# EAGLE design Millable_AS726x_Breakout (EAGLE 7.7.0)
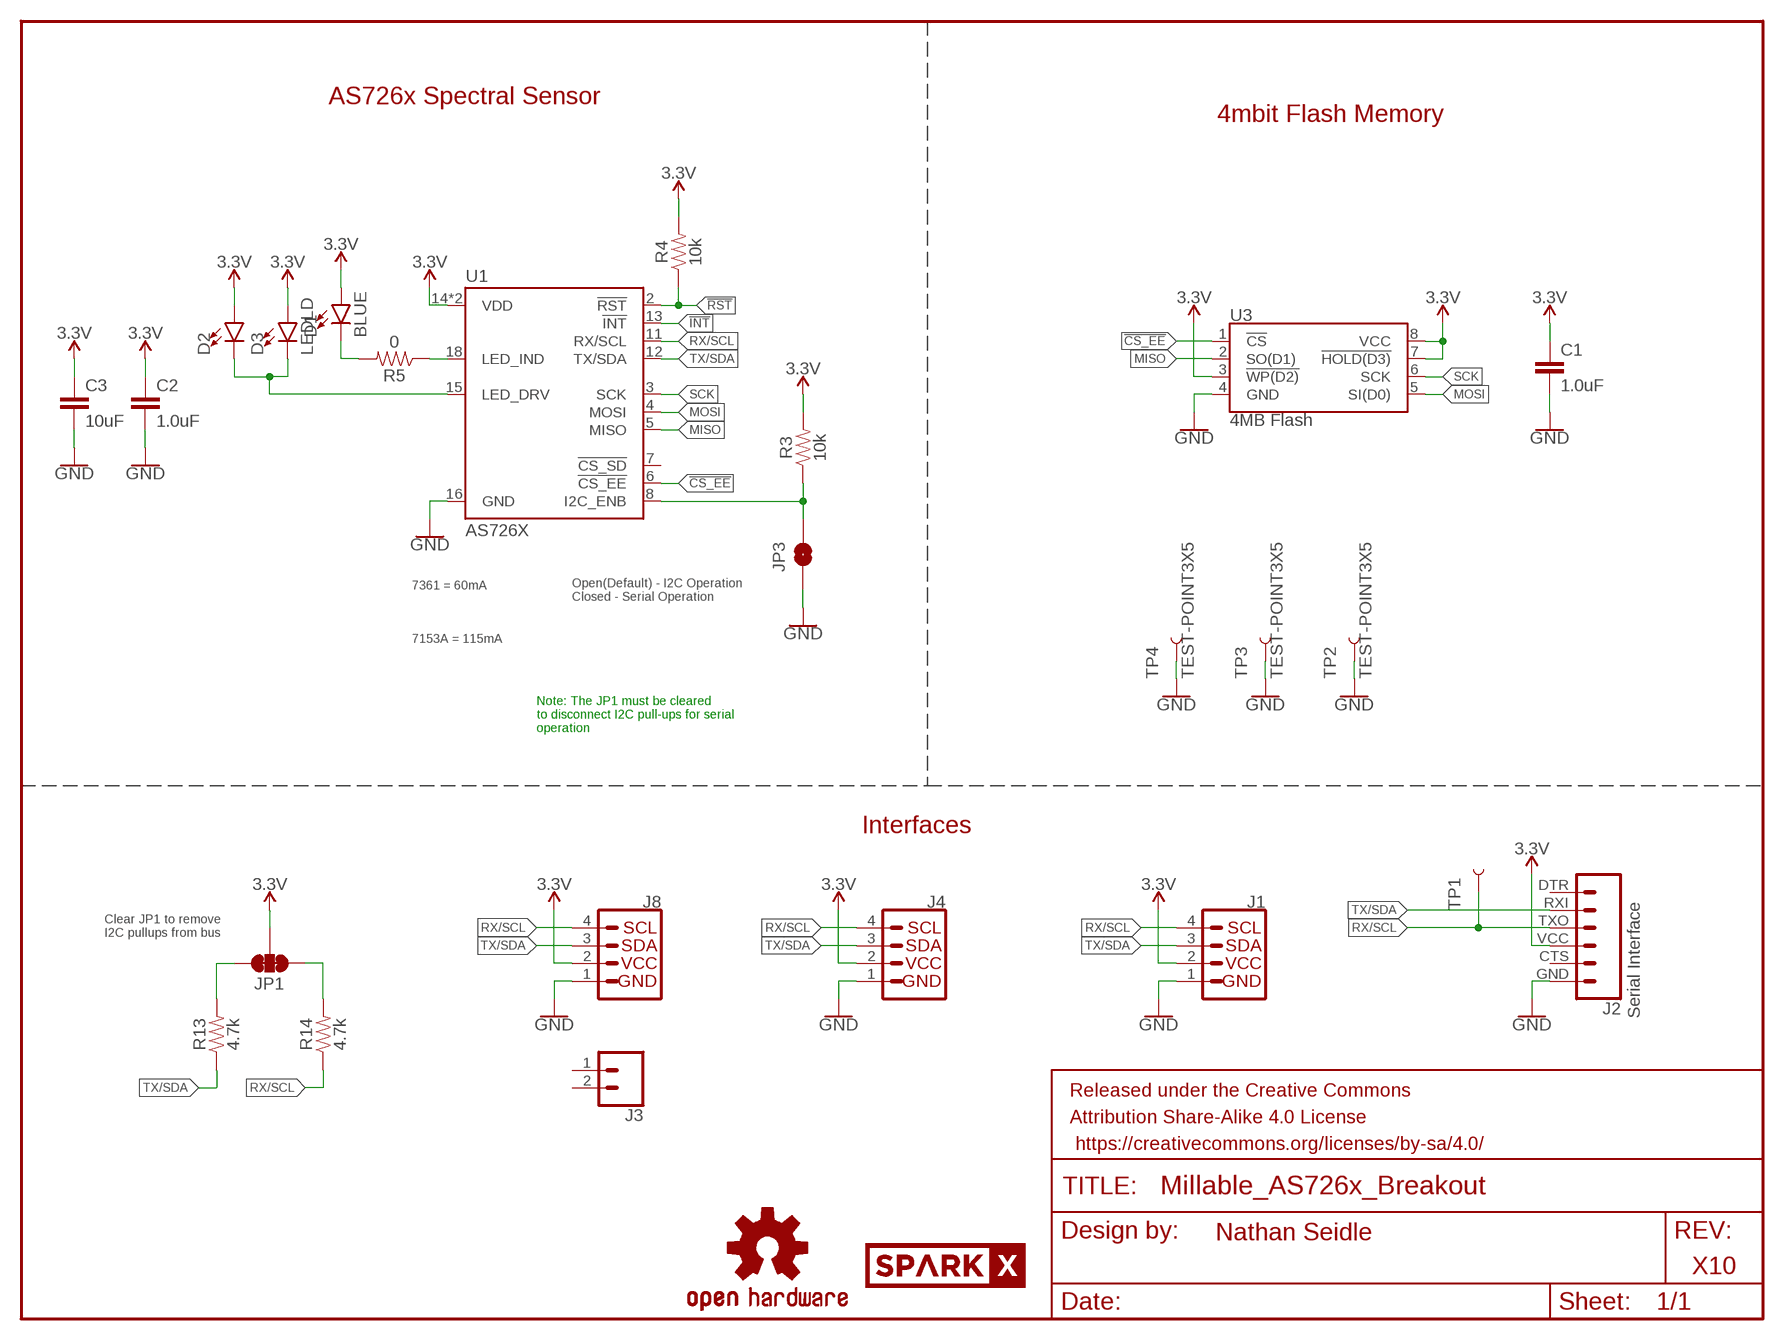
[diagram p0: schematic, sheet 1]

## Parts
C1  1.0uF  1.0UF-0603-16V-10%  [0603]
C2  1.0uF  1.0UF-0603-16V-10%  [0603]
C3  10uF  10UF-0603-6.3V-20%  [0603]
D1  BLUE  LED-BLUE0603  [LED-0603]
D2  LED5MM  [LED_5MM]
D3  LEDLD  [SUPER_BRIGHT_SMD_LED_1206]
FRAME1  FRAME-LETTER  [CREATIVE_COMMONS]
J1  I2C_STANDARDJS-1MM  [1X04_1MM_RA]
J2  Serial Interface  6_PIN_SERIAL_CABLEPTH  [FTDI_BASIC]
J3  CONN_021X02_NO_SILK  [1X02_NO_SILK]
J4  I2C_STANDARDJS-1MM  [1X04_1MM_RA]
J8  I2C_STANDARD_NO_SILK  [1X04_NO_SILK]
JP1  JUMPER-SMT_3_2-NC_TRACE_SILK  [SMT-JUMPER_3_2-NC_TRACE_SILK]
JP3  JUMPER-SMT_2_NO-MILLABLE_NO-SILK  [SMT-JUMPER_2_NO_NO-SILK]
LOGO4  OSHW-LOGOS  [OSHW-LOGO-S]
R3  10k  10KOHM-0603-1/10W-1%  [0603]
R4  10k  10KOHM-0603-1/10W-1%  [0603]
R5  0  0OHM-0603-1/10W-5%  [0603]
R13  4.7k  4.7KOHM-0603-1/10W-1%  [0603]
R14  4.7k  4.7KOHM-0603-1/10W-1%  [0603]
TP1  TEST-POINT3X5  [PAD.03X.05]
TP2  TEST-POINT3X5  [PAD.03X.05]
TP3  TEST-POINT3X5  [PAD.03X.05]
TP4  TEST-POINT3X5  [PAD.03X.05]
U1  AS726X  [LGA20]
U3  4MB Flash  AT25SF041  [SO08]
U$1  SPARKX-LOGO3  [SPARKX-SMALL]

## Nets
3.3V: C1.1 C2.1 C3.1 D1.A D2.A D3.A J1.2(VCC) J2.VCC J4.2(VCC) J8.2 JP1.2 R3.2 R4.2 U1.14(VDD) U1.17(VDD) U3.3(!WP(D2)) U3.7(!HOLD(D3)) U3.8(VCC)
!CS_EE: U1.6(!CS_EE) U3.1(!CS)
!INT: U1.13(!INT)
!RST: R4.1 U1.2(!RST)
GND: C1.2 C2.2 C3.2 J1.1(GND) J2.GND J4.1(GND) J8.1 JP3.1 TP2.P$1 TP3.P$1 TP4.P$1 U1.16(GND) U3.4(GND)
I2C_ENB: JP3.2 R3.1 U1.8(I2C_ENB)
MISO: U1.5(MISO) U3.2(SO(D1))
MOSI: U1.4(MOSI) U3.5(SI(D0))
N$2: R5.1 U1.18(LED_IND)
N$3: D1.C R5.2
N$4: JP1.3 R13.2
N$5: JP1.1 R14.2
N$6: D2.K(C) D3.C U1.15(LED_DRV)
RX/SCL: J1.4(SCL) J2.TXO J4.4(SCL) J8.4 R14.1 TP1.P$1 U1.11(RX/SCL)
SCK: U1.3(SCK) U3.6(SCK)
TX/SDA: J1.3(SDA) J2.RXI J4.3(SDA) J8.3 R13.1 U1.12(TX/SDA)
Unconnected: J2.CTS J2.DTR J3.1 J3.2 U1.7(!CS_SD)

## Notes on the sheet
- AS726x Spectral Sensor
- 4mbit Flash Memory
- 7361 = 60mA
- Open(Default) - I2C Operation
  Closed - Serial Operation
- 7153A = 115mA
- Note: The JP1 must be cleared
  to disconnect I2C pull-ups for serial
  operation
- Interfaces
- Clear JP1 to remove
  I2C pullups from bus
- Nathan Seidle
- X10

## Library data of the parts
C1 C2 = SparkFun-Capacitors:1.0UF: 1µF ceramic capacitors A capacitor is a passive two-terminal electrical component used to store electrical energy temporarily in an electric field.; PROD_ID: CAP-00868
C3 = SparkFun-Capacitors:10UF: 10.0µF ceramic capacitors A capacitor is a passive two-terminal electrical component used to store electrical energy temporarily in an electric field.; PROD_ID: CAP-11015
D1 = SparkFun-LED:LED-BLUE: Blue SMD LED Used in manufacturing of various products at SparkFun Packages: 0603 - SMD 0603 package [Product Link] <http://www.digikey.com/product-detail/en/SMLE12BC7TT86/511-1589-2-ND/1641808> 1206 - SMD1206 package [Product Link] <http://www.digikey.com/product-detail/en/lite-on-inc/LTST-C150TBKT/160-1643-1-ND/573584> SparkFun Products: ESP8266 Thing-Dev Board <https://www.sparkfun.com/products/13711> RedBoard <https://www.sparkfun.com/products/12757>; PROD_ID: DIO-08575
D2 = SparkFun-LED:LED: LED (Generic) Standard schematic elements and footprints for 5mm, 3mm, 1206, and 0603 sized LEDs. Generic LEDs with no color specified.
D3 = SparkX:LED
FRAME1 = SparkFun-Aesthetics:FRAME-LETTER: Schematic Frame - Letter Standard 8.5x11 US Letter frame
J1 J4 = SparkX:I2C_STANDARD: SparkFun I2C Standard Pinout Header SparkFun has standardized on a pinout for all I2C based sensor breakouts. This pinout allows I2C boards to be plugged directly into the headers on Arduino Uno compatible boards, and to be daisy chained easily. Example SparkFun Products: SparkFun Atmospheric Sensor Breakout - BME280 <https://www.sparkfun.com/products/13676> SparkFun Altitude/Pressure Sensor Breakout - MPL3115A2 <https://www.sparkfun.com/products/11084> SparkFun TOF Range Finder Sensor - VL6180 <https://www.sparkfun.com/products/12785>
J2 = SparkFun-Connectors:6_PIN_SERIAL_CABLE: 6-pin header connection for use with the "FTDI BASIC" pinout - CABLE SIDE. Also known as "Arduino Serial Program Header". This is used on a design to provide a 6-pin connection point for serial communication usually from a USB cable (D+/D-) to these headers (RX/TX). It also has the remaining pins necessary for programming in the Arduino evironment (DTR, GND, and sometimes VCC). Note, this device has "CABLE" in the name. It is intended to be used on a design that usually lives on the end of your USB cable and prvides the converter chip (FTDI232 or FTDI231x) to commnicate serial RX/TX. The "sister" device, named "TARGET" is inteneded to be used on a design that contains a target micro-controller that you wish to program. You can populate with some of these: Female Headers <https://www.sparkfun.com/products/115> (PRT-00115) For reference (or to suit your programming needs) check out these designs: SparkFun FTDI Basic Breakout - 5V <https://www.sparkfun.com/products/9716> (DEV-09716) SparkFun FTDI Basic Breakout - 3.3V <https://www.sparkfun.com/products/9873> (DEV-09873) SparkFun FTDI SmartBasic <https://www.sparkfun.com/products/12935> (DEV-12935) SparkFun Beefy 3 - FTDI Basic Breakout <https://www.sparkfun.com/products/13746> (DEV-13746)
J3 = SparkFun-Connectors:CONN_02: Multi connection point. Often used as Generic Header-pin footprint for 0.1 inch spaced/style header connections On any of the 0.1 inch spaced packages, you can populate with these: Break Away Headers - Straight <https://www.sparkfun.com/products/116> (PRT-00116) Break Away Male Headers - Right Angle <https://www.sparkfun.com/products/553> (PRT-00553) Female Headers <https://www.sparkfun.com/products/115> (PRT-00115) Break Away Headers - Machine Pin <https://www.sparkfun.com/products/117> (PRT-00117) Break Away Female Headers - Swiss Machine Pin <https://www.sparkfun.com/products/743> (PRT-00743) For SCREWTERMINALS and SPRING TERMINALS visit here: Screw Terimnals on SparkFun.com <https://www.sparkfun.com/search/results?term=Screw+Terminals> (5mm/3.5mm/2.54mm spacing) This device is also useful as a general connection point to wire up your design to another part of your project. Our various solder wires solder well into these plated through hole pads. Hook-Up Wire - Assortment (Stranded, 22 AWG) <https://www.sparkfun.com/products/11375> (PRT-11375) Hook-Up Wire - Assortment (Solid Core, 22 AWG) <https://www.sparkfun.com/products/11367> (PRT-11367) View the entire wire category on our website here <https://www.sparkfun.com/categories/141> Special notes: Molex polarized connector foot print use with: PRT-08233 with associated crimp pins and housings. 2.54_SCREWTERM for use with PRT-10571. 3.5mm Screw Terminal footprints for PRT-08084 5mm Screw Terminal footprints for use with PRT-08432
J8 = SparkFun-Connectors:I2C_STANDARD: SparkFun I2C Standard Pinout Header SparkFun has standardized on a pinout for all I2C based sensor breakouts. This pinout allows I2C boards to be plugged directly into the headers on Arduino Uno compatible boards, and to be daisy chained easily. Example SparkFun Products: SparkFun Atmospheric Sensor Breakout - BME280 <https://www.sparkfun.com/products/13676> SparkFun Altitude/Pressure Sensor Breakout - MPL3115A2 <https://www.sparkfun.com/products/11084> SparkFun TOF Range Finder Sensor - VL6180 <https://www.sparkfun.com/products/12785>
JP1 = SparkFun-Jumpers:JUMPER-SMT_3_2-NC_TRACE: Normally closed trace jumper (2 of 2 connections) This jumper has a trace between all three pads so they are normally closed (NC). Use a razor knife to open the connection(s). For best results follow the IPC guidelines for cutting traces: Cutout at least 0.063 mm (0.005 in). Remove all loose material to clean up the cut area. Seal the cut with an approved epoxy. Reapply solder to reclose the connection(s).
JP3 = SparkX:JUMPER-SMT_2_NO-MILLABLE: Normally open jumper This jumper has two pads in close proximity to each other. Apply solder to close the connection. Round pads are easier to solder for beginners, but are a lot larger. SparkFun Product that uses the round pads: SparkFun EL Sequencer <https://www.sparkfun.com/products/12781>
LOGO4 = SparkFun-Aesthetics:OSHW-LOGO: Open-Source Hardware (OSHW) Logo This logo indicates the piece of hardware it is found on incorporates a OSHW license and/or adheres to the definition of open source hardware found here: http://freedomdefined.org/OSHW
R3 R4 = SparkFun-Resistors:10KOHM: 10kΩ resistor A resistor is a passive two-terminal electrical component that implements electrical resistance as a circuit element. Resistors act to reduce current flow, and, at the same time, act to lower voltage levels within circuits. - Wikipedia; PROD_ID: RES-00824
R5 = SparkFun-Resistors:0OHM: 0Ω resistor A resistor is a passive two-terminal electrical component that implements electrical resistance as a circuit element. Resistors act to reduce current flow, and, at the same time, act to lower voltage levels within circuits. - Wikipedia; PROD_ID: RES-08609
R13 R14 = SparkFun-Resistors:4.7KOHM: 4.7kΩ resistor A resistor is a passive two-terminal electrical component that implements electrical resistance as a circuit element. Resistors act to reduce current flow, and, at the same time, act to lower voltage levels within circuits. - Wikipedia; PROD_ID: RES-07857
TP1-TP4 = SparkFun-Connectors:TEST-POINT: SparkFun Test Points Bare copper test points for troubleshooting or In-Circuit-Testing. These are used by our Production team for verifying production board runs using pogo-pins on test beds. SparkFun Products: SparkFun LSM9DS1 Breakout <https://www.sparkfun.com/products/13284> SparkFun PSOC <https://www.sparkfun.com/products/13714> SparkFun Load Cell Amplifier <https://www.sparkfun.com/products/13879>
U1 = SparkX:AS726X
U3 = SparkFun-IC-Memory:AT25SF041: AT25SF041 4Mb Serial Flash Memory 104MHz, SPI, 8-SOIC Datasheet <http://www.adestotech.com/wp-content/uploads/DS-AT25SF041_044.pdf> SparkFun Products: SparkFun ESP8266 Thing <https://www.sparkfun.com/products/13231> SparkFun ESP8266 Thing - Dev Board <https://www.sparkfun.com/products/13711>; PROD_ID: IC-12455
U$1 = SparkX:SPARKX-LOGO

## Board
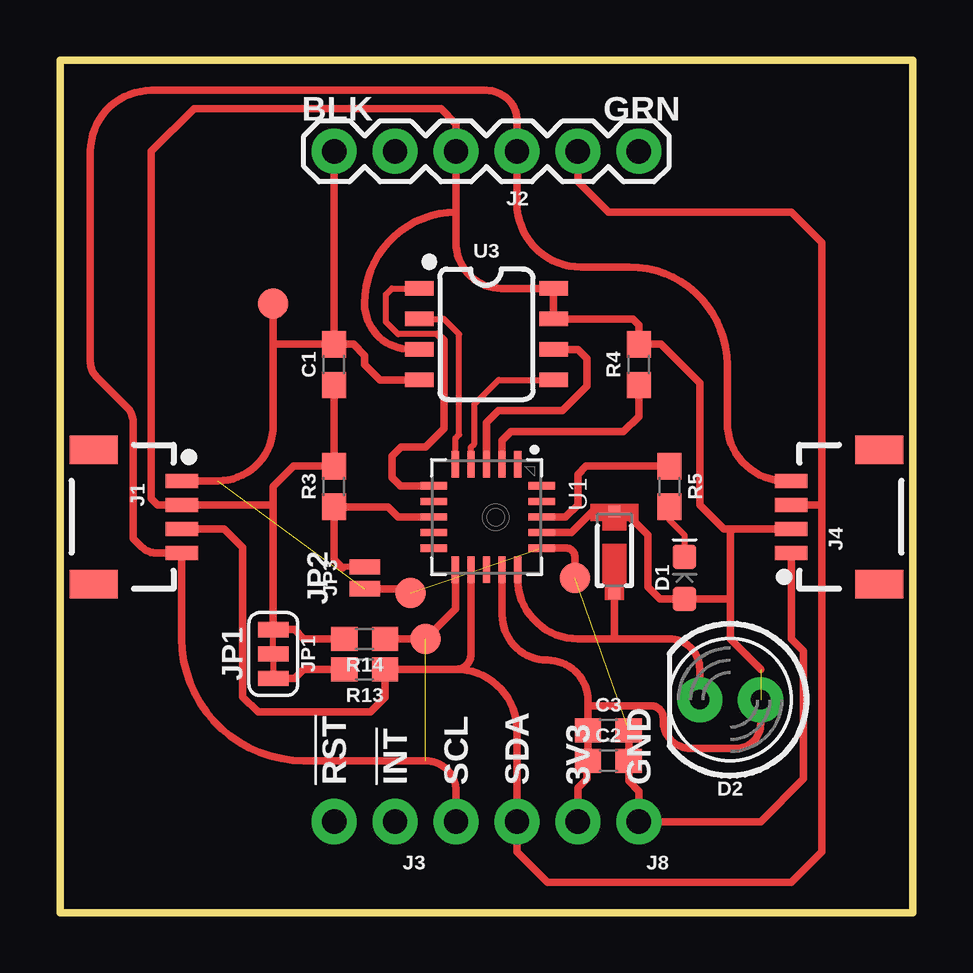
[diagram p1: board, top side]
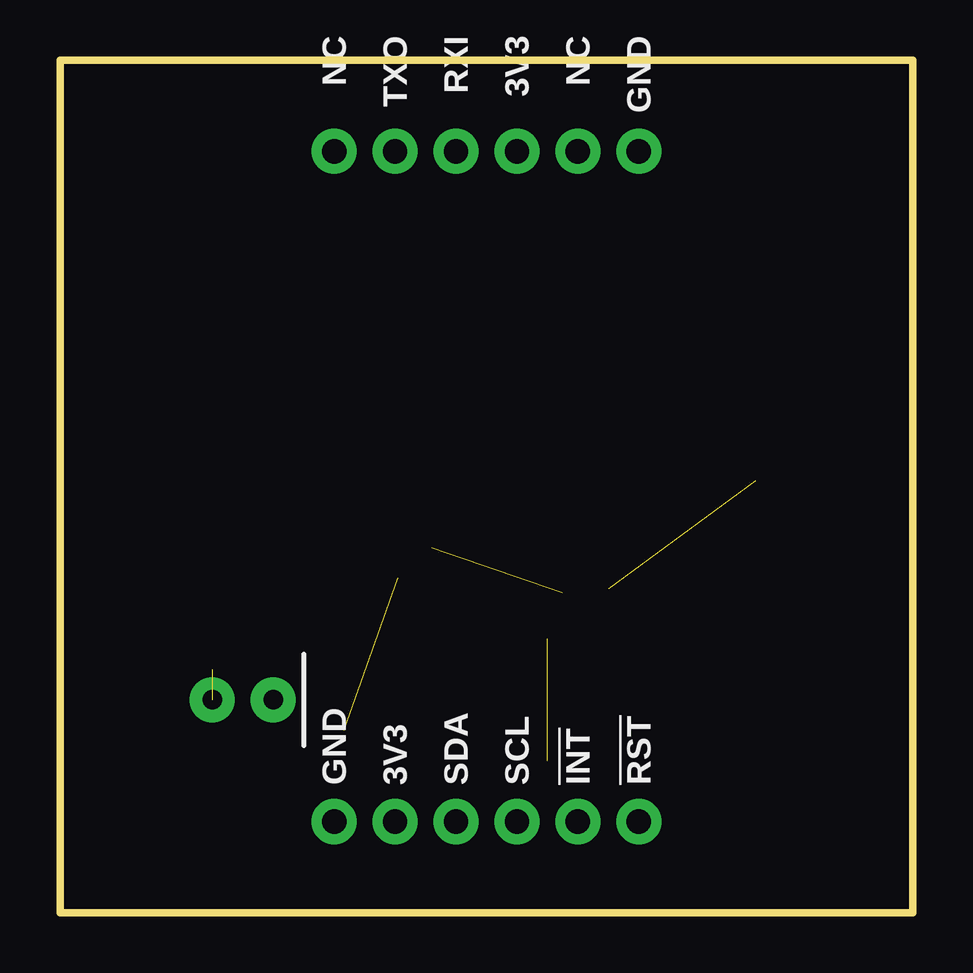
[diagram p2: board, bottom side, seen from below]

Size 35.56 x 35.56 mm. Coordinates in mm from the lower left corner, seen from the top.
Outline: 0,0 0,35.56 35.56,35.56 35.56,0 0,0
Copper layers (1*16): Top 0.035mm / dielectric 1.5mm / Bottom 0.035mm
Design rules "SparkFun-2-layer-TIGHT": minimum track width 7mil, minimum drill 15mil, track to track 7mil, track to pad 7mil, pad to pad 7mil, via to via 7mil, smd to smd 7mil, copper to edge 7mil, drill to drill 7mil, minimum pad ring 7mil, minimum via ring 7mil, stop-mask expansion 4mil, vias tented up to drill 25mil, thermal gap 10mil

### Footprints (pad centres in the part's own frame; a part is rotated, then mirrored left to right if it is on the bottom)
0603 = smd 1.1 x 1: 1 -0.85,0; 2 0.85,0
LED-0603 = smd 1 x 1: A -0.877,0; C 0.877,0
LED_5MM = drill 0.813 pad 1.88: A -1.27,0; K 1.27,0
SUPER_BRIGHT_SMD_LED_1206 = smd 0.5 x 0.5: A -1.5,0; C 1.9,0
1X04_1MM_RA = smd 0.6 x 1.35: 1 -1.5,0; 2 -0.5,0; 3 0.5,0; 4 1.5,0 | smd 1.2 x 2: NC1 2.8,-3.675; NC2 -2.8,-3.675
FTDI_BASIC = drill 1.016 pad 1.88: CTS 10.16,0; DTR 0,0; GND 12.7,0; RXI 2.54,0; TXO 5.08,0; VCC 7.62,0
1X02_NO_SILK = drill 1.016 pad 1.88: 1 0,0; 2 2.54,0
1X04_NO_SILK = drill 1.016 pad 1.88: 1 0,0; 2 2.54,0; 3 5.08,0; 4 7.62,0
SMT-JUMPER_3_2-NC_TRACE_SILK = smd 0.635 x 1.27: 1 -1.016,0; 2 0,0; 3 1.016,0
SMT-JUMPER_2_NO_NO-SILK = smd 0.635 x 1.27: 1 -0.456,0; 2 0.456,0
PAD.03X.05 = smd 1.27 x 1.27: P$1 0,0
LGA20 = smd 1.1 x 0.3: 1 -2.2,1.3; 2 -2.2,0.65; 3 -2.2,0; 4 -2.2,-0.65; 5 -2.2,-1.3; 11 2.2,-1.3; 12 2.2,-0.65; 13 2.2,0; 14 2.2,0.65; 15 2.2,1.3 | smd 0.3 x 1.1: 6 -1.3,-2.2; 7 -0.65,-2.2; 8 0,-2.2; 9 0.65,-2.2; 10 1.3,-2.2; 16 1.3,2.3; 17 0.65,2.3; 18 0,2.3; 19 -0.65,2.3; 20 -1.3,2.3
SO08 = smd 0.6 x 1.2: 1 -1.905,-2.8; 2 -0.635,-2.8; 3 0.635,-2.8; 4 1.905,-2.8; 5 1.905,2.8; 6 0.635,2.8; 7 -0.635,2.8; 8 -1.905,2.8

### Placement (x,y rotation side)
C1  11.43,22.86 90 top
C2  22.86,6.35 0 top
C3  22.86,7.62 0 top
D1  26.04,13.97 90 top
D2  27.94,8.89 180 top
D3  23.11,15.24 270 top
FRAME1  -13.97,-21.59 0 top  (outside the outline)
J1  5.08,16.51 270 top
J2  24.13,31.75 180 top
J3  13.97,3.81 180 top
J4  30.48,16.51 90 top
J8  24.13,3.81 180 top
JP1  8.89,10.79 270 top
JP3  12.7,13.97 90 top
LOGO4  19.05,40.64 0 bottom  (outside the outline)
R3  11.43,17.78 90 top
R4  24.13,22.86 90 top
R5  25.4,17.78 270 top
R13  12.7,10.16 180 top
R14  12.7,11.43 180 top
TP1  15.24,11.43 0 top
TP2  21.46,13.97 0 top
TP3  14.61,13.34 0 top
TP4  8.89,25.4 0 top
U1  17.78,16.51 270 top
U3  17.78,24.13 270 top
U$1  12.45,40.64 0 top  (outside the outline)

### Tracks (layer width: path | path; a pad name or v marks a point on that pad's centre or on a via)
3.3V  (1 unrouted)
  Top 0.305: 8.88,17.01 J1.2 4.07,17.01 3.81,17.27 3.81,31.75 5.59,33.53 15.88,33.53 16.51,32.89 J2.VCC 16.51,29.21 | C1.1 R3.2 9.74,18.63 8.88,17.77 8.88,17.01 | 8.88,17.01 8.89,17.02 8.89,11.81 | J4.2 28.07,16.01 | 28.07,16.01 27.68,16.01 26.67,17.02 26.67,22.1 25.06,23.71 R4.2 24.13,24.51 23.88,24.77 U3.7 U3.8 18.41,26.04 arc-90 16.51,27.94 16.51,29.21 | U1.17 21.32,15.86 22.2,16.74 D3.A 23.52,16.74 24.51,15.75 24.51,13.59 25.02,13.08 26.02,13.08 D1.A 27.93,13.09 27.94,13.08 | J8.2 21.59,5.21 21.97,5.59 21.97,6.31 C2.1 C3.1 22.01,8.51 | 29.21,10.16 27.94,11.43 27.94,13.08 | 27.94,13.08 27.94,15.88 28.07,16.01 | U3.3 14.61,23.5 arc-90 12.7,25.4 arc-90 16.51,29.21 | 22.01,8.51 22.01,8.85 arc90 20.32,10.54 arc-90 18.43,12.43 U1.14 | D2.A 29.21,7.87 arc-90 28.19,6.86 26.29,6.86 arc-90 25.15,8 25.15,8.13 arc90 24.64,8.64 22.14,8.64 arc90 22.01,8.51
!CS_EE
  Top 0.254: 15.75,24.13 14.1,24.13 13.59,24.64 13.59,25.78 13.84,26.04 U3.1
  Top 0.305: U1.6 14.19,17.81 13.84,18.16 13.84,19.05 14.22,19.43 15.24,19.43 16,20.19 16,23.88 15.75,24.13
!RST
  Top 0.305: U1.2 18.43,19.7 18.8,20.07 23.5,20.07 24.13,20.7 R4.1
GND  (3 unrouted)
  Top 0.305: C1.2 J2.GND | U3.4 13.34,22.23 12.7,22.86 12.7,23.24 12.23,23.71 C1.2 | C3.2 C2.2 23.71,5.5 24.13,5.08 J8.1 29.21,3.81 30.99,5.59 30.99,10.92 30.48,11.43 J4.1 | U1.16 21.11,15.21 arc-90 21.46,14.86 TP2.P$1 | JP3.1 14.43,13.51 arc-90 TP3.P$1 | J1.1 6.58,18.01 arc90 8.89,20.32 8.89,23.62 | 8.89,23.62 TP4.P$1 | C1.2 8.98,23.71 arc90 8.89,23.62
I2C_ENB
  Top 0.254: JP3.2 11.84,14.43 11.79,14.38
  Top 0.305: U1.8 14.1,16.51 13.68,16.93 R3.1 11.43,14.73 11.79,14.38
MISO
  Top 0.254: U1.5 16.48,19.78 16.64,19.94 16.64,24.13 16,24.77 U3.2
MOSI
  Top 0.254: U1.4 17.13,19.42 17.27,19.56 17.27,21.21 18.29,22.23 U3.5
N$2
  Top 0.305: U1.18 21.08,16.51 21.59,17.02 21.59,18.29 21.93,18.63 R5.1
N$3
  Top 0.254: R5.2 25.4,16.38 26.04,15.75 D1.C
N$4
  Top 0.305: JP1.3 9.78,9.78 10.16,10.16 R13.2
N$5
  Top 0.305: JP1.1 9.78,11.81 10.16,11.43 R14.2
N$6
  Top 0.305: U1.15 19.08,13.94 arc90 21.59,11.43 23.11,11.43 | D3.C 23.11,11.43 | D2.K 26.67,10.16 arc90 25.4,11.43 23.11,11.43
RX/SCL  (1 unrouted)
  Top 0.305: U1.11 16.48,12.67 TP1.P$1 R14.1 | J8.4 16.51,5.08 arc90 15.24,6.35 10.16,6.35 arc-90 5.08,11.43 J1.4 4.01,15.01 arc-45 3.41,15.26 3.05,15.62 3.05,20.48 arc45 2.8,21.07 1.52,22.36 arc-45 1.27,22.95 1.27,31.75 arc-90 3.81,34.29 17.78,34.29 arc-90 19.05,33.02 J2.TXO 19.05,29.59 arc90 21.72,26.92 23.75,26.92 arc-90 27.81,22.86 27.81,20.45 arc90 30.25,18.01 J4.4
SCK
  Top 0.305: U1.3 17.78,20.45 18.29,20.95 20.95,20.95 21.97,21.97 21.97,23.11 21.59,23.5 U3.6
TX/SDA
  Top 0.305: J2.RXI 21.59,30.48 22.86,29.21 30.48,29.21 31.75,27.94 31.75,17.02 | 31.75,17.02 31.75,2.54 30.48,1.27 20.32,1.27 19.05,2.54 J8.3 19.05,7.62 arc90 16.51,10.16 | J4.3 31.74,17.01 31.75,17.02 | J1.3 6.85,16.01 7.62,15.24 7.62,9.02 8.26,8.38 12.95,8.38 13.55,8.98 R13.1 16.51,10.16 | U1.12 17.13,10.78 arc-90 16.51,10.16

### Text on the board
tPlace: BLK | GRN | JP2 | JP1 | !RST | !INT | SCL | SDA | 3V3 | GND
bPlace: GND | NC | 3V3 | RXI | TXO | NC | !RST | !INT | SCL | SDA | 3V3 | GND
tDocu: Nathan Seidle